# Altium project STM_BLUEPILL.PrjPcb
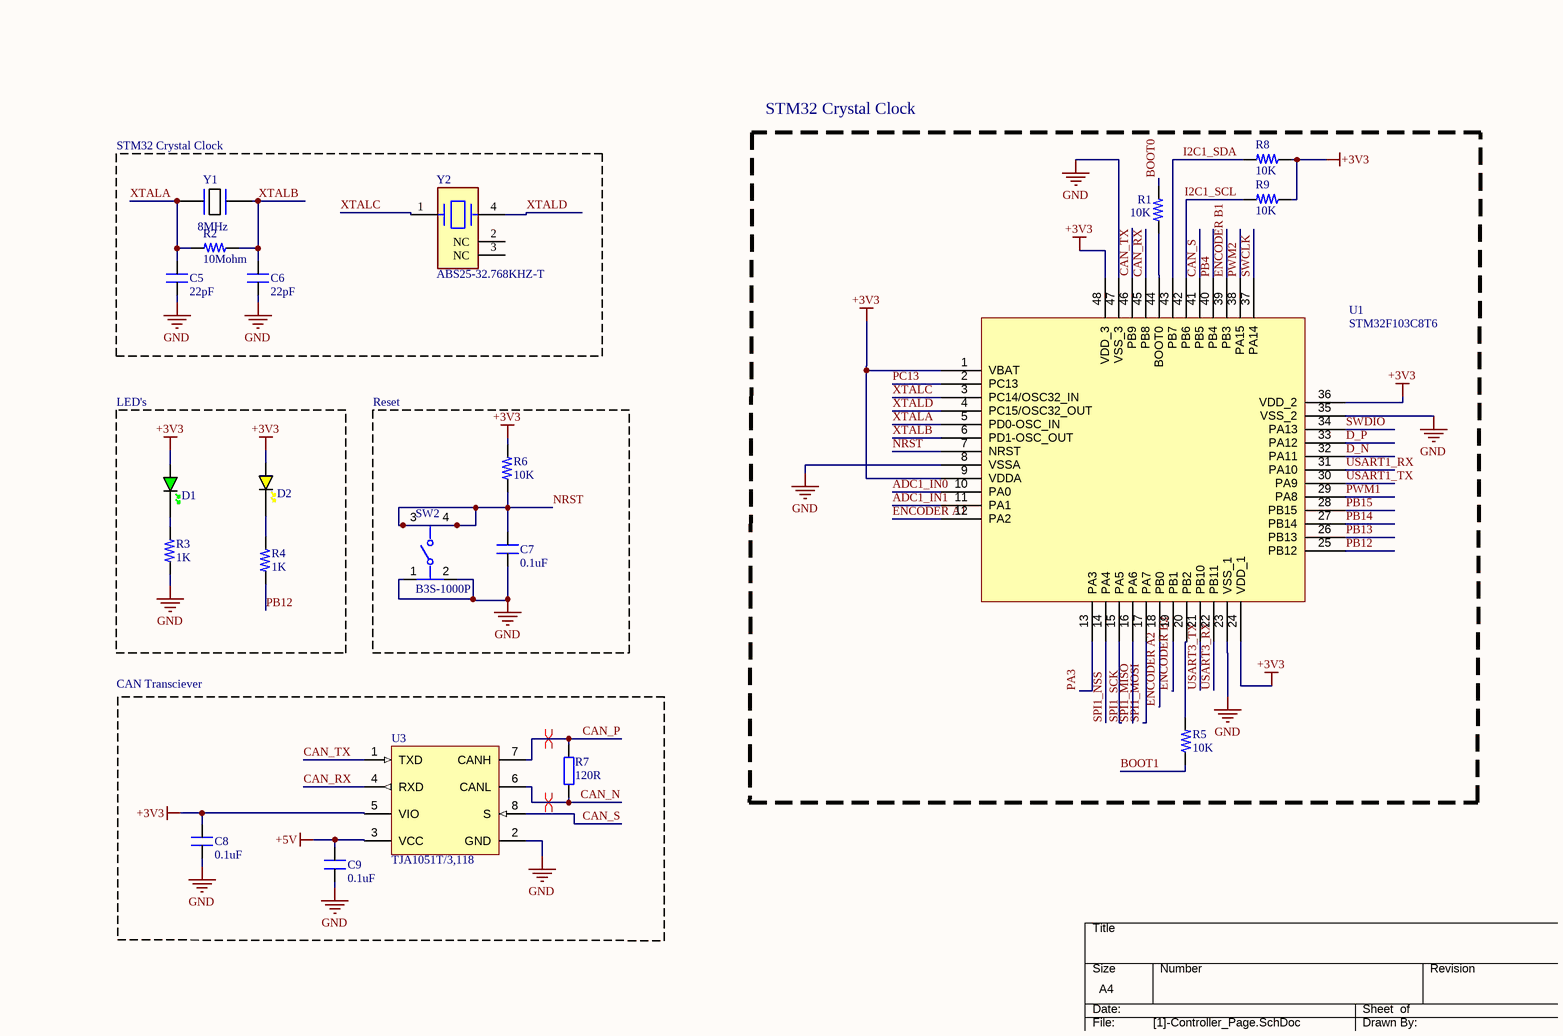
[diagram p0: [1]-Controller_Page.SchDoc]
3 sheets, 47 parts. Net scope: global (net labels, ports and power ports of the same name join across sheets).
Board file: STM_BLUEPILL.PcbDoc
Sheets:
  [1]-Controller_Page.SchDoc
  [2]- Connector_Page.SchDoc
  [3]-PowerIN_Page.SchDoc

## Sheet [1]-Controller_Page.SchDoc: STM Bluepill
size A4; DrawnBy: Aviral Mishra; DocumentNumber: 1; Revision: V1.0; SheetNumber: 1; SheetTotal: 2; Company Name: Esteem PCB

### Parts
C5  22pF  [CAP_0805]
C6  22pF  [CAP_0805]
C7  0.1uF  [CAP_0805]
C8  0.1uF  [CAP_0805]
C9  0.1uF  [CAP_0805]
D1  GREEN  [LED_0402_GREEN]  (value not drawn)
D2  YELLOW  [LED_0402_YELLOW]  (value not drawn)
R1  10K  [RES_0805]
R2  10Mohm  [RES_0805]
R3  1K  [RES_0805]
R4  1K  [RES_0805]
R5  10K  [RES_0805]
R6  10K  [RES_0805]
R7  120R  [RES_0805]
R8  10K  [RES_0805]
R9  10K  [RES_0805]
SW2  B3S-1000P  [FP-B3S-1000P-MFG]
U1  STM32F103C8T6  [LQFP-48_19.6_393_58X11_SMD]
U3  TJA1051T/3,118  [NXP-SOIC-8_L]
Y1  8MHz  [XTAL_314_240X47_SMD]
Y2  ABS25-32.768KHZ-T  [FP-ABS25-MFG]

### Blocks framed on the sheet
STM32 Crystal Clock: R1 R5 R8 R9 U1
STM32 Crystal Clock: C5 C6 R2 Y1 Y2
LED's: D1 D2 R3 R4
Reset: C7 R6 SW2
CAN Transciever: C8 C9 R7 U3

### Nets
+3V3: C8.2 D1.A D2.A R6.2 R8.2 R9.2 U1.1(VBAT) U1.9(VDDA) U1.24(VDD_1) U1.36(VDD_2) U1.48(VDD_3) U3.5(VIO)
+5V: C9.2 U3.3(VCC)
GND: C5.1 C6.1 C7.1 C8.1 C9.1 R3.1 SW2.1 SW2.2 U1.8(VSSA) U1.23(VSS_1) U1.35(VSS_2) U1.47(VSS_3) U3.2(GND)
ADC1_IN0: U1.10(PA0)
ADC1_IN1: U1.11(PA1)
BOOT0: R1.2
BOOT1: R5.2
CAN_N: R7.1 U3.6(CANL)
CAN_P: R7.2 U3.7(CANH)
CAN_RX: U1.45(PB8) U3.4(RXD)
CAN_S: U1.41(PB5) U3.8(S)
CAN_TX: U1.46(PB9) U3.1(TXD)
D_N: U1.32(PA11)
D_P: U1.33(PA12)
ENCODER A1: U1.12(PA2)
ENCODER A2: U1.18(PB0)
ENCODER B1: U1.39(PB3)
ENCODER B2: U1.19(PB1)
I2C1_SCL: R9.1 U1.42(PB6)
I2C1_SDA: R8.1 U1.43(PB7)
NRST: C7.2 R6.1 SW2.3 SW2.4 U1.7(NRST)
PA3: U1.13(PA3)
PB4: U1.40(PB4)
PB12: R4.1 U1.25(PB12)
PB13: U1.26(PB13)
PB14: U1.27(PB14)
PB15: U1.28(PB15)
PC13: U1.2(PC13)
PWM1: U1.29(PA8)
PWM2: U1.38(PA15)
SPI1_MISO: U1.16(PA6)
SPI1_MOSI: U1.17(PA7)
SPI1_NSS: U1.14(PA4)
SPI1_SCK: U1.15(PA5)
SWCLK: U1.37(PA14)
SWDIO: U1.34(PA13)
USART1_RX: U1.31(PA10)
USART1_TX: U1.30(PA9)
USART3_RX: U1.22(PB11)
USART3_TX: U1.21(PB10)
XTALA: C5.2 R2.1 U1.5(PD0-OSC_IN) Y1.1
XTALB: C6.2 R2.2 U1.6(PD1-OSC_OUT) Y1.2
XTALC: U1.3(PC14/OSC32_IN) Y2.1
XTALD: U1.4(PC15/OSC32_OUT) Y2.4
NetD1_K: D1.K R3.2
NetD2_K: D2.K R4.2
NetR1_1: R1.1 U1.44(BOOT0)
NetR5_1: R5.1 U1.20(PB2)

Not connected (* = marked no-connect by the designer): Y2 2(NC) 3(NC)

### Layout directives
differential pair; differential pair class *: CAN_P
differential pair; net class *: CAN_N

### Notes on the sheet
- DWG. NO.
- REV.
- SHT.
- THIS DOCUMENT AND THE DATA DISCLOSED HEREIN OR HEREWITH IS THE PROPERTY OF ALTIUM LIMITED AND MAY BE FREELY DISTRIBUTED IN WHOLE. NO RIGHTS ARE RESERVED OR EXPRESS OR IMPLIED WARANTEE GIVEN.
- REVISION
- DESCRIPTION
- DATE
- APPROVED
- ENG:
- APPROVALS
- PROJECT
- DSN:
- CHK:
- REFERENCE DOCUMENTS
- PROJECT REVISION:
- TITLE
- DOCUMENT REVISION:
- DESIGN ITEM:
- BOM:
- FAB DWG:
- PCB DWG:
- ASSY DWG:
- SCALE:
- SIZE
- B
- CAGE CODE
- FILE NAME
- DWG NO.
- SHEET
- OF
- REV

### Library data of the parts
C5 C6 = CAP_22pF-50V-5%-0805: 22pF ±5% 50V Ceramic Capacitor C0G, NP0 0805 (2012 Metric); Manufacturer: KEMET; Manufacturer Part Number: C0805C220J5GACTU; Case/Package: 0805; Supplier-1: Digikey; Supplier Part Number-1: 399-1113-1-ND
C7-C9 = CAP_0.1uF-50V-5%-0805: 0.1µF ±5% 50V Ceramic Capacitor X7R 0805 (2012 Metric); Manufacturer: KEMET; Manufacturing Part Number: C0805C104J5RACTU; Case/Package: 0805 (2012 Metric); Supplier-1: Digikey; Supplier Part Number-1: 399-1171-1-ND
D1 = LED_0402_GREEN: LED 0402 GREEN SMD
D2 = LED_0402_YELLOW: LED 0402 YELLOW SMD
R1 R5 R6 R8 R9 = RES_10K-0.125W-1%-0805: 10 kOhms ±1% 0.125W, 1/8W Chip Resistor 0805 (2012 Metric) Moisture Resistant Thick Film; Manufacturer: Yageo; Manufacturing Part Number: RC0805FR-0710KL; Case/Package: 0805; Supplier-1: Digikey; Supplier Part Number-1: 311-10.0KCRCT-ND
R2 = RES_10MOHM-0.125W-1%-0805: 10 MOhms ±1% 0.125W, 1/8W Chip Resistor 0805 (2012 Metric) Automotive AEC-Q200, High Voltage Thick Film; Manufacturer: Rohm Semiconductor; Manufacturing Part Number: KTR10EZPF1005; Case/Package: 0805 (2012 Metric); Supplier-1: Digikey; Supplier Part Number-1: RHM10.0MAHCT-ND
R3 R4 = RES_1K-0.125W-1%-0805: 1 kOhms ±1% 0.125W, 1/8W Chip Resistor 0805 (2012 Metric) Moisture Resistant Thick Film; Manufacturer: 垈㎵á; Manufacturer Part Number: RC0805FR-071KL; Case/Package: 0805; Supplier-1: Digikey; Supplier Part Number-1: 311-1.00KCRCT-ND
R7 = RES_0805: Resistor SMD 0805; Manufacturer: *; Manufacturer Part Number: *; Distributor Link: *; LCSC: *
SW2 = CMP-08834-000008-1: SWITCH TACTILE SPST-NO 0.05A 24V; Throw Configuration: SPST; Switch Function: Off-Mom; Switch Travel: 0.25mm; Contact Current Rating: 50mA; Actuator Length: 0.8mm; Mechanical Life: 500000Cycles; Contact Resistance: 100mR; Operating Force: 1.57N; Actuator Type: Standard; Illumination Type: Non-Illuminated; Ratings: IP67; Number of Poles: 1; Package Quantity: 1; Orientation: Straight; REACH SVHC: No SVHC; Lead Free: Lead Free; Max Current Rating: 50mA; Contact Plating: Silver; Current Rating: 50mA; Depth: 9mm; Contact Material: Bronze; Electrical Life: 500000Cycles; Termination: Gull Wing; Width: 6mm; Packaging: Tape and Reel; Min Operating Temperature: -25°C; Radiation Hardening: No; Max Voltage Rating (DC): 24V; Max Operating Temperature: 70°C; Length: 6.6mm; Height: 3.65mm; Voltage Rating (DC): 24V; Weight: 0.010582oz; Mount: Surface Mount
U1 = IC-STM32F103C8T6 _1: ARM® Cortex®-M3 STM32F1 Microcontroller IC 32-Bit 72MHz 64KB (64K x 8) FLASH; Manufacturer: STMicroelectronics; Manufacturer Part Number: STM32F103C8T6; Case/Package: 48-LQFP; Supplier-1: Digikey; Supplier Part Number-1: 497-6063-ND
U3 = CMP-2000-07245-1: High-Speed CAN Transceiver, 3 to 5 V, 8-Pin SOIC (SOT96-1), RoHS, Tape and Reel; Manufacturer: NXP; Power Down Mode: Normal/Silent; Rad Hardened: No; Number of Transceivers: 1; Supply Current: 70mA; Operating Supply Voltage (Max): 5.5V; Operating Supply Voltage (Typ): 5V; Operating Supply Voltage (Min): 4.5V; Standard Supported: ISO11898-2; Data Rate: 1Mbps; DELETED: Compliant; Operating Temperature (Min): -40C; Datasheet Version: Rev. 7, 01/2015; Pin Count: 8; Operating Temperature (Max): 125C; Package Description: 8-Pin Small Outline Integrated Circuit, Body 4.9 x 3.9 mm, Pitch 1.27 mm; Category: Transceiver; Packaging: TapeandReel; Mounting: SurfaceMount; Package Reference: SOT96-1; Operating Temperature Classification: Automotive; Mounting Technology: SurfaceMount; Package Type: SO; Manufacturer URL: http://www.nxp.com/; Datasheet URL: http://www.nxp.com/documents/data_sheet/TJA1051.pdf
Y1 = XTAL_8MHZ-LFXTAL030234: Crystals 8MHz 22pF -20C 70C; Manufacturer: IQD Frequency Products; Manufacturing Part Number: LFXTAL030234Reel; Case/Package: SMD; Supplier-1: Mouser; Supplier Part Number-1: 449-LFXTAL030234REEL
Y2 = CMP-2000-05037-2: CRYSTAL 32.7680KHZ 12.5PF SMD; ESR (Equivalent Series Resistance): 50kR; Tolerance: 20ppm; Width: 3.8mm; REACH SVHC: No SVHC; Load Capacitance: 12.5pF; Case/Package: SMD/SMT; Radiation Hardening: No; Series: ABS25; Number of Pins: 4; Mount: Surface Mount; RoHS Compliant: Yes; Packaging: Tape and Reel; Termination: SMD/SMT; Frequency Tolerance: 20ppm; Lead Free: Lead Free; Package Quantity: 1000; Min Operating Temperature: -40°C; Height: 0.098inch; Length: 8mm; Frequency: 32.768kHz; Max Operating Temperature: 85°C; Series Resistance: 50kR; Operating Frequency: 32.768 kHz; Depth: 3.8mm

## Sheet [2]- Connector_Page.SchDoc: STM Bluepill
size A4; DrawnBy: Aviral Mishra; DocumentNumber: 2; Revision: V1.0; SheetNumber: 2; SheetTotal: 2; Company Name: Esteem PCB
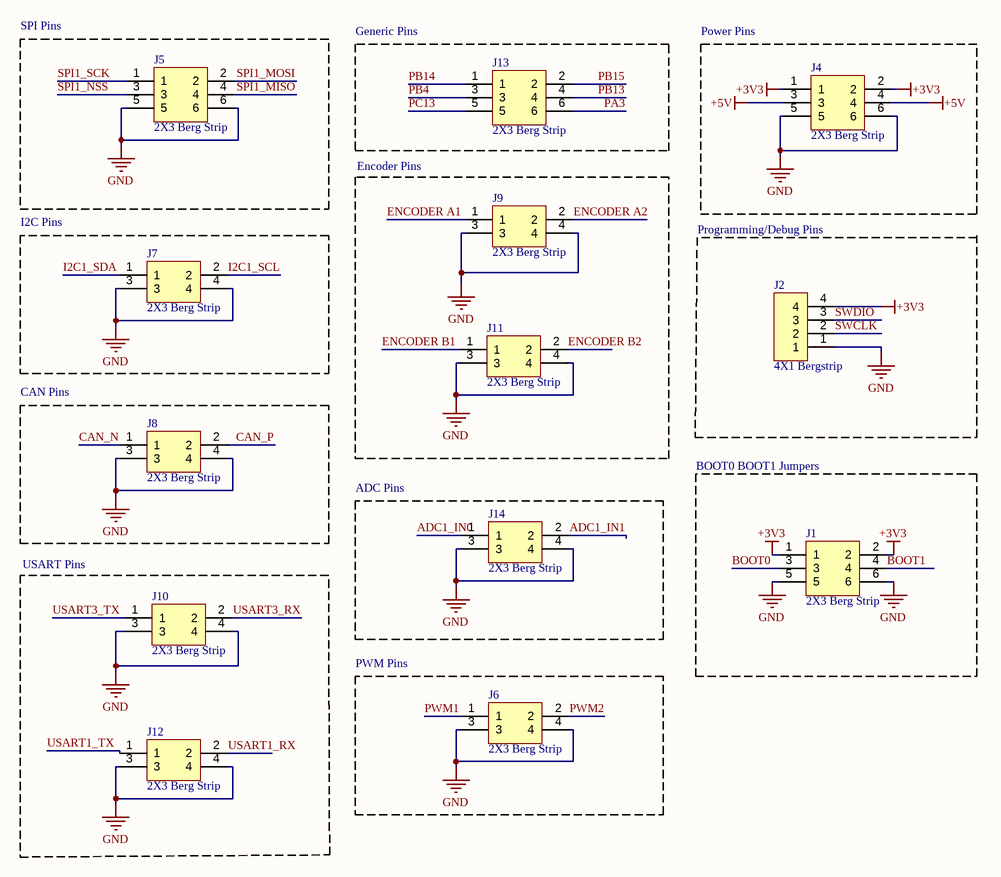
[diagram p1: [2]- Connector_Page.SchDoc]

### Parts
J1  2X3 Berg Strip  [CON6_100_59D78_TH_ST_Duplicate]
J2  4X1 Bergstrip  [CON4_100_40D72_TH_ST_MALE]
J4  2X3 Berg Strip  [CON6_100_59D78_TH_ST_Duplicate]
J5  2X3 Berg Strip  [CON6_100_59D78_TH_ST_Duplicate]
J6  2X3 Berg Strip  [CON4_100_59D78_TH_ST_Duplicate]
J7  2X3 Berg Strip  [CON4_100_59D78_TH_ST_Duplicate]
J8  2X3 Berg Strip  [CON4_100_59D78_TH_ST_Duplicate]
J9  2X3 Berg Strip  [CON4_100_59D78_TH_ST_Duplicate]
J10  2X3 Berg Strip  [CON4_100_59D78_TH_ST_Duplicate]
J11  2X3 Berg Strip  [CON4_100_59D78_TH_ST_Duplicate]
J12  2X3 Berg Strip  [CON4_100_59D78_TH_ST_Duplicate]
J13  2X3 Berg Strip  [CON6_100_59D78_TH_ST_Duplicate]
J14  2X3 Berg Strip  [CON4_100_59D78_TH_ST_Duplicate]

### Blocks framed on the sheet
SPI Pins: J5
Generic Pins: J13
Power Pins: J4
Encoder Pins: J9 J11
I2C Pins: J7
Programming/Debug Pins: J2
CAN Pins: J8
BOOT0 BOOT1 Jumpers: J1
ADC Pins: J14
USART Pins: J10 J12
PWM Pins: J6

### Nets
+3V3: J1.1 J1.2 J2.4 J4.1 J4.2
+5V: J4.3 J4.4
GND: J1.5 J1.6 J2.1 J4.5 J4.6 J5.5 J5.6 J6.3 J6.4 J7.3 J7.4 J8.3 J8.4 J9.3 J9.4 J10.3 J10.4 J11.3 J11.4 J12.3 J12.4 J14.3 J14.4
ADC1_IN0: J14.1
ADC1_IN1: J14.2
BOOT0: J1.3
BOOT1: J1.4
CAN_N: J8.1
CAN_P: J8.2
ENCODER A1: J9.1
ENCODER A2: J9.2
ENCODER B1: J11.1
ENCODER B2: J11.2
I2C1_SCL: J7.2
I2C1_SDA: J7.1
PA3: J13.6
PB4: J13.3
PB13: J13.4
PB14: J13.1
PB15: J13.2
PC13: J13.5
PWM1: J6.1
PWM2: J6.2
SPI1_MISO: J5.4
SPI1_MOSI: J5.2
SPI1_NSS: J5.3
SPI1_SCK: J5.1
SWCLK: J2.2
SWDIO: J2.3
USART1_RX: J12.2
USART1_TX: J12.1
USART3_RX: J10.2
USART3_TX: J10.1

### Notes on the sheet
- DWG. NO.
- REV.
- SHT.
- THIS DOCUMENT AND THE DATA DISCLOSED HEREIN OR HEREWITH IS THE PROPERTY OF ALTIUM LIMITED AND MAY BE FREELY DISTRIBUTED IN WHOLE. NO RIGHTS ARE RESERVED OR EXPRESS OR IMPLIED WARANTEE GIVEN.
- REVISION
- DESCRIPTION
- DATE
- APPROVED
- ENG:
- APPROVALS
- PROJECT
- DSN:
- CHK:
- REFERENCE DOCUMENTS
- PROJECT REVISION:
- TITLE
- DOCUMENT REVISION:
- DESIGN ITEM:
- BOM:
- FAB DWG:
- PCB DWG:
- ASSY DWG:
- SCALE:
- SIZE
- B
- CAGE CODE
- FILE NAME
- DWG NO.
- SHEET
- OF
- REV

### Library data of the parts
J1 J4 J5 J13 = CON-BS-PLG_2X3-100-TH-ST: 6 pin, 2 row, 2.54mm pitch bergstrip; Manufacturer: NA; Manufacturer Part Number: NA; Case/Package: TH; Supplier-1: NA; Supplier Part Number-1: NA
J2 = CON-BS-PLG_4X1-100-TH-ST: 4 pin, 1 row, 2.54mm pitch bergstrip; Manufacturer: NA; Manufacturing Part Number: NA; Case/Package: TH; Supplier-1: NA; Supplier Part Number-1: NA
J6-J12 J14 = CON-BS-PLG_2X2-100-TH-ST: 4 pin, 2 row, 2.54mm pitch bergstrip

## Sheet [3]-PowerIN_Page.SchDoc
size A4
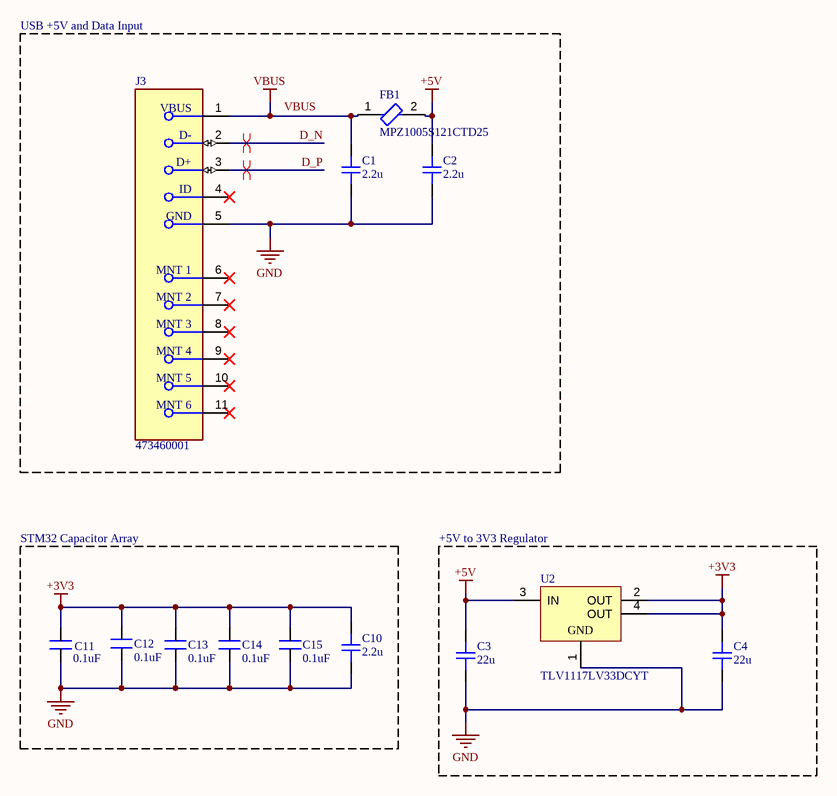
[diagram p2: [3]-PowerIN_Page.SchDoc]

### Parts
C1  2.2u  [CAP_0603]
C2  2.2u  [CAP_0603]
C3  22u  [CAP_0805]
C4  22u  [CAP_0805]
C10  2.2u  [CAP_0603]
C11  0.1uF  [CAP_0805]
C12  0.1uF  [CAP_0805]
C13  0.1uF  [CAP_0805]
C14  0.1uF  [CAP_0805]
C15  0.1uF  [CAP_0805]
FB1  MPZ1005S121CTD25  [FP-MPZ1005-IPC_C]
J3  473460001  [FP-473460001-MFG]
U2  TLV1117LV33DCYT  [DCY0004A_M]

### Blocks framed on the sheet
USB +5V and Data Input: C1 C2 FB1 J3
STM32 Capacitor Array: C10-C15
+5V to 3V3 Regulator: C3 C4 U2

### Nets
+3V3: C4.2 C10.2 C11.2 C12.2 C13.2 C14.2 C15.2 U2.2(OUT) U2.4(OUT)
+5V: C2.2 C3.2 FB1.2 U2.3(IN)
GND: C1.1 C2.1 C3.1 C4.1 C10.1 C11.1 C12.1 C13.1 C14.1 C15.1 J3.5(GND) U2.1(GND)
VBUS: C1.2 FB1.1 J3.1(VBUS)
D_N: J3.2(D-)
D_P: J3.3(D+)

Not connected (* = marked no-connect by the designer): J3 4(ID)* 6(MNT_1)* 7(MNT_2)* 8(MNT_3)* 9(MNT_4)* 10(MNT_5)* 11(MNT_6)*

### Layout directives
differential pair; differential pair class DIFF_USB: D_N, D_P

### Notes on the sheet
- Labels drawn without touching a wire or pin: VBUS
- DWG. NO.
- REV.
- SHT.
- THIS DOCUMENT AND THE DATA DISCLOSED HEREIN OR HEREWITH IS THE PROPERTY OF ALTIUM LIMITED AND MAY BE FREELY DISTRIBUTED IN WHOLE. NO RIGHTS ARE RESERVED OR EXPRESS OR IMPLIED WARANTEE GIVEN.
- REVISION
- DESCRIPTION
- DATE
- APPROVED
- ENG:
- APPROVALS
- PROJECT
- DSN:
- CHK:
- REFERENCE DOCUMENTS
- PROJECT REVISION:
- TITLE
- DOCUMENT REVISION:
- DESIGN ITEM:
- BOM:
- FAB DWG:
- PCB DWG:
- ASSY DWG:
- SCALE:
- SIZE
- B
- CAGE CODE
- FILE NAME
- DWG NO.
- SHEET
- OF
- REV

### Library data of the parts
C1 C2 C10 = CAP_0603: Capacitor SMD 0603; Manufacturer: *; Manufacturer Part Number: *; Distributor Link: *; LCSC: *; Rating: *; Dielectric: *
C3 C4 = CAP_0805: Capacitor SMD 0805; Manufacturer: *; Manufacturer Part Number: *; Distributor Link: *; LCSC: *; Rating: *; Dielectric: *
C11-C15 = CAP_0.1uF-50V-5%-0805: as C7 on sheet [1]-Controller_Page; Case/Package: 0805 (2012 Metric); Supplier-1: Digikey; Supplier Part Number-1: 399-1171-1-ND
FB1 = CMP-08257-000074-1: Power line Ferrite Bead 120Ω @ 100MHz 1.2A DCR 0.09Ω AEC-Q200 SMD 0402; Number of Lines: 1; Tolerance: 25%; DC Resistance (DCR): 90mR; Impedance: 120R; Width: 0.02inch; Weight: 2.3E-05oz; Max DC Current: 1.2A; Test Frequency: 100MHz; Packaging: Tape and Reel; Ratings: AEC-Q200; Package Quantity: 10000; Length: 0.039inch; Max Current Rating: 1.2A; Case Code (Metric): 1005; Mount: Surface Mount; Termination: SMD/SMT; Max Operating Temperature: 125°C; Height: 0.022inch; Min Operating Temperature: -55°C; Case Code (Imperial): 0402; Lead Free: Lead Free; Case/Package: 0402; RoHS Compliant: Yes
J3 = CMP-2000-05246-2: CONN RCPT USB2.0 MICRO B SMD R/A; Manufacturer: Molex; Conn Orientation: Right Angle; Is Female: yes; Shielding: true; Pitch: 0.65mm; Number Of Contacts: 5; Voltage Rating: 30V; Current Rating: 1.8A; Device Class L2: USB Connectors; Digikey Description: CONN RCPT USB2.0 MICRO B SMD R/A; Height: 2.945mm; RoHS: TRUE; ComponentLink2Description: Datasheet; Octopart: https://octopart.com/47346-0001-molex-7164928; Automotive: No; Package: 0; Category: Conn; Device Class L1: Connectors; Usb Standard: USB 2.0; Temperature: -30°C to +85°C; Temperature Range Low: -30°C; Footprint Url: https://www.molex.com/pdm_docs/sd/473460001_sd.pdf; ComponentLink2URL: https://www.molex.com/webdocs/datasheets/pdf/en-us/0473460001_IO_CONNECTORS.pdf; Lead Free: Yes; Manufacturer Part Number: 473460001; Contact Material: Gold,Nickel; Temperature Range High: +85°C; Device Class L3: unset
U2 = CMP-0395-00499-2: Single Output LDO, 1 A, Fixed 3.3 V Output, 2 to 5.5 V Input, 4-pin SOT-223 (DCY), -40 to 125 degC, Green (RoHS & no Sb/Br); Manufacturer: Texas Instruments; Vout Adj(Max)(V): 3.3; Iout(Max)(A): 1; SubFamily: Single Channel LDO; Iq(Typ)(mA): 0.05; Accuracy(%): 2; Vin(Max)(V): 5.5; Vdo(Typ)(mV): 1200; PartNumber: TLV1117LV33DCYT; PackageReference: DCY0004A; PackageVersion: 4202506/B; ComponentLink1URL: http://www.ti.com/; DatasheetVersion: SBVS160A; Mounting Technology: Surface Mount; Fixed Output Options(V): 3.3; ComponentLink3Description: Package Specification; PackageDescription: 4-Pin Plastic Small Outline, Body 3.5 x 6.5 mm, Pitch 2.3 mm; Vout Adj(Min)(V): 3.3; ComponentLink2URL: http://www.ti.com/general/docs/lit/getliterature.tsp?genericPartNumber=TLV1117LV33&fileType=pdf; Code_JEDEC: TO-261; ComponentLink1Description: Manufacturer URL; Vin(Min)(V): 2; ComponentLink2Description: Datasheet; Eco-Plan: Green (RoHS & no Sb/Br); ComponentLink3URL: http://www.ti.com/litv/pdf/mpds094a

## Nets that join several sheets
+3V3: [1]-Controller_Page (12 pins), [2]- Connector_Page (5 pins), [3]-PowerIN_Page (9 pins)
+5V: [1]-Controller_Page (C9.2 U3.3), [2]- Connector_Page (J4.3 J4.4), [3]-PowerIN_Page (C2.2 C3.2 FB1.2 U2.3)
GND: [1]-Controller_Page (13 pins), [2]- Connector_Page (23 pins), [3]-PowerIN_Page (12 pins)
ADC1_IN0: [1]-Controller_Page (U1.10), [2]- Connector_Page (J14.1)
ADC1_IN1: [1]-Controller_Page (U1.11), [2]- Connector_Page (J14.2)
BOOT0: [1]-Controller_Page (R1.2), [2]- Connector_Page (J1.3)
BOOT1: [1]-Controller_Page (R5.2), [2]- Connector_Page (J1.4)
CAN_N: [1]-Controller_Page (R7.1 U3.6), [2]- Connector_Page (J8.1)
CAN_P: [1]-Controller_Page (R7.2 U3.7), [2]- Connector_Page (J8.2)
D_N: [1]-Controller_Page (U1.32), [3]-PowerIN_Page (J3.2)
D_P: [1]-Controller_Page (U1.33), [3]-PowerIN_Page (J3.3)
ENCODER A1: [1]-Controller_Page (U1.12), [2]- Connector_Page (J9.1)
ENCODER A2: [1]-Controller_Page (U1.18), [2]- Connector_Page (J9.2)
ENCODER B1: [1]-Controller_Page (U1.39), [2]- Connector_Page (J11.1)
ENCODER B2: [1]-Controller_Page (U1.19), [2]- Connector_Page (J11.2)
I2C1_SCL: [1]-Controller_Page (R9.1 U1.42), [2]- Connector_Page (J7.2)
I2C1_SDA: [1]-Controller_Page (R8.1 U1.43), [2]- Connector_Page (J7.1)
PA3: [1]-Controller_Page (U1.13), [2]- Connector_Page (J13.6)
PB4: [1]-Controller_Page (U1.40), [2]- Connector_Page (J13.3)
PB13: [1]-Controller_Page (U1.26), [2]- Connector_Page (J13.4)
PB14: [1]-Controller_Page (U1.27), [2]- Connector_Page (J13.1)
PB15: [1]-Controller_Page (U1.28), [2]- Connector_Page (J13.2)
PC13: [1]-Controller_Page (U1.2), [2]- Connector_Page (J13.5)
PWM1: [1]-Controller_Page (U1.29), [2]- Connector_Page (J6.1)
PWM2: [1]-Controller_Page (U1.38), [2]- Connector_Page (J6.2)
SPI1_MISO: [1]-Controller_Page (U1.16), [2]- Connector_Page (J5.4)
SPI1_MOSI: [1]-Controller_Page (U1.17), [2]- Connector_Page (J5.2)
SPI1_NSS: [1]-Controller_Page (U1.14), [2]- Connector_Page (J5.3)
SPI1_SCK: [1]-Controller_Page (U1.15), [2]- Connector_Page (J5.1)
SWCLK: [1]-Controller_Page (U1.37), [2]- Connector_Page (J2.2)
SWDIO: [1]-Controller_Page (U1.34), [2]- Connector_Page (J2.3)
USART1_RX: [1]-Controller_Page (U1.31), [2]- Connector_Page (J12.2)
USART1_TX: [1]-Controller_Page (U1.30), [2]- Connector_Page (J12.1)
USART3_RX: [1]-Controller_Page (U1.22), [2]- Connector_Page (J10.2)
USART3_TX: [1]-Controller_Page (U1.21), [2]- Connector_Page (J10.1)